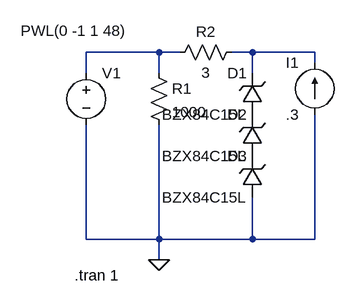
[diagram p0: schematic panel_sim.asc]
panel_sim.asc, the LTspice schematic file:
Version 4
SHEET 1 880 680
WIRE 144 96 32 96
WIRE 176 96 144 96
WIRE 288 96 256 96
WIRE 384 96 288 96
WIRE 384 112 384 96
WIRE 32 128 32 96
WIRE 144 128 144 96
WIRE 288 128 288 96
WIRE 32 384 32 208
WIRE 144 384 144 208
WIRE 144 384 32 384
WIRE 288 384 288 320
WIRE 288 384 144 384
WIRE 384 384 384 192
WIRE 384 384 288 384
WIRE 144 416 144 384
FLAG 144 416 0
SYMBOL res 128 112 R0
SYMATTR InstName R1
SYMATTR Value 1000
SYMBOL res 272 80 R90
WINDOW 0 0 56 VBottom 2
WINDOW 3 32 56 VTop 2
SYMATTR InstName R2
SYMATTR Value 3
SYMBOL zener 304 192 R180
WINDOW 0 24 64 Left 2
WINDOW 3 24 0 Left 2
SYMATTR InstName D1
SYMATTR Value BZX84C15L
SYMATTR Description Diode
SYMATTR Type diode
SYMBOL current 384 192 R180
WINDOW 0 24 80 Left 2
WINDOW 3 24 0 Left 2
WINDOW 123 0 0 Left 2
WINDOW 39 0 0 Left 2
SYMATTR InstName I1
SYMATTR Value .3
SYMBOL voltage 32 112 R0
WINDOW 3 -101 -49 Left 2
WINDOW 123 0 0 Left 2
WINDOW 39 0 0 Left 2
SYMATTR InstName V1
SYMATTR Value PWL(0 -1 1 48)
SYMBOL zener 304 256 R180
WINDOW 0 24 64 Left 2
WINDOW 3 24 0 Left 2
SYMATTR InstName D2
SYMATTR Value BZX84C15L
SYMATTR Description Diode
SYMATTR Type diode
SYMBOL zener 304 320 R180
WINDOW 0 24 64 Left 2
WINDOW 3 24 0 Left 2
SYMATTR InstName D3
SYMATTR Value BZX84C15L
SYMATTR Description Diode
SYMATTR Type diode
TEXT 14 440 Left 2 !.tran 1

The netlist it stands for:
* panel_sim.asc
R1 N001 0 1000
R2 N002 N001 3
D1 P001 N002 BZX84C15L
I1 0 N002 .3
V1 N001 0 PWL(0 -1 1 48)
D2 P002 P001 BZX84C15L
D3 0 P002 BZX84C15L
.model D D
.lib standard.dio
.tran 1
.backanno
.end